# EAGLE schematic bc29_anz_a (EAGLE 7.2.0)
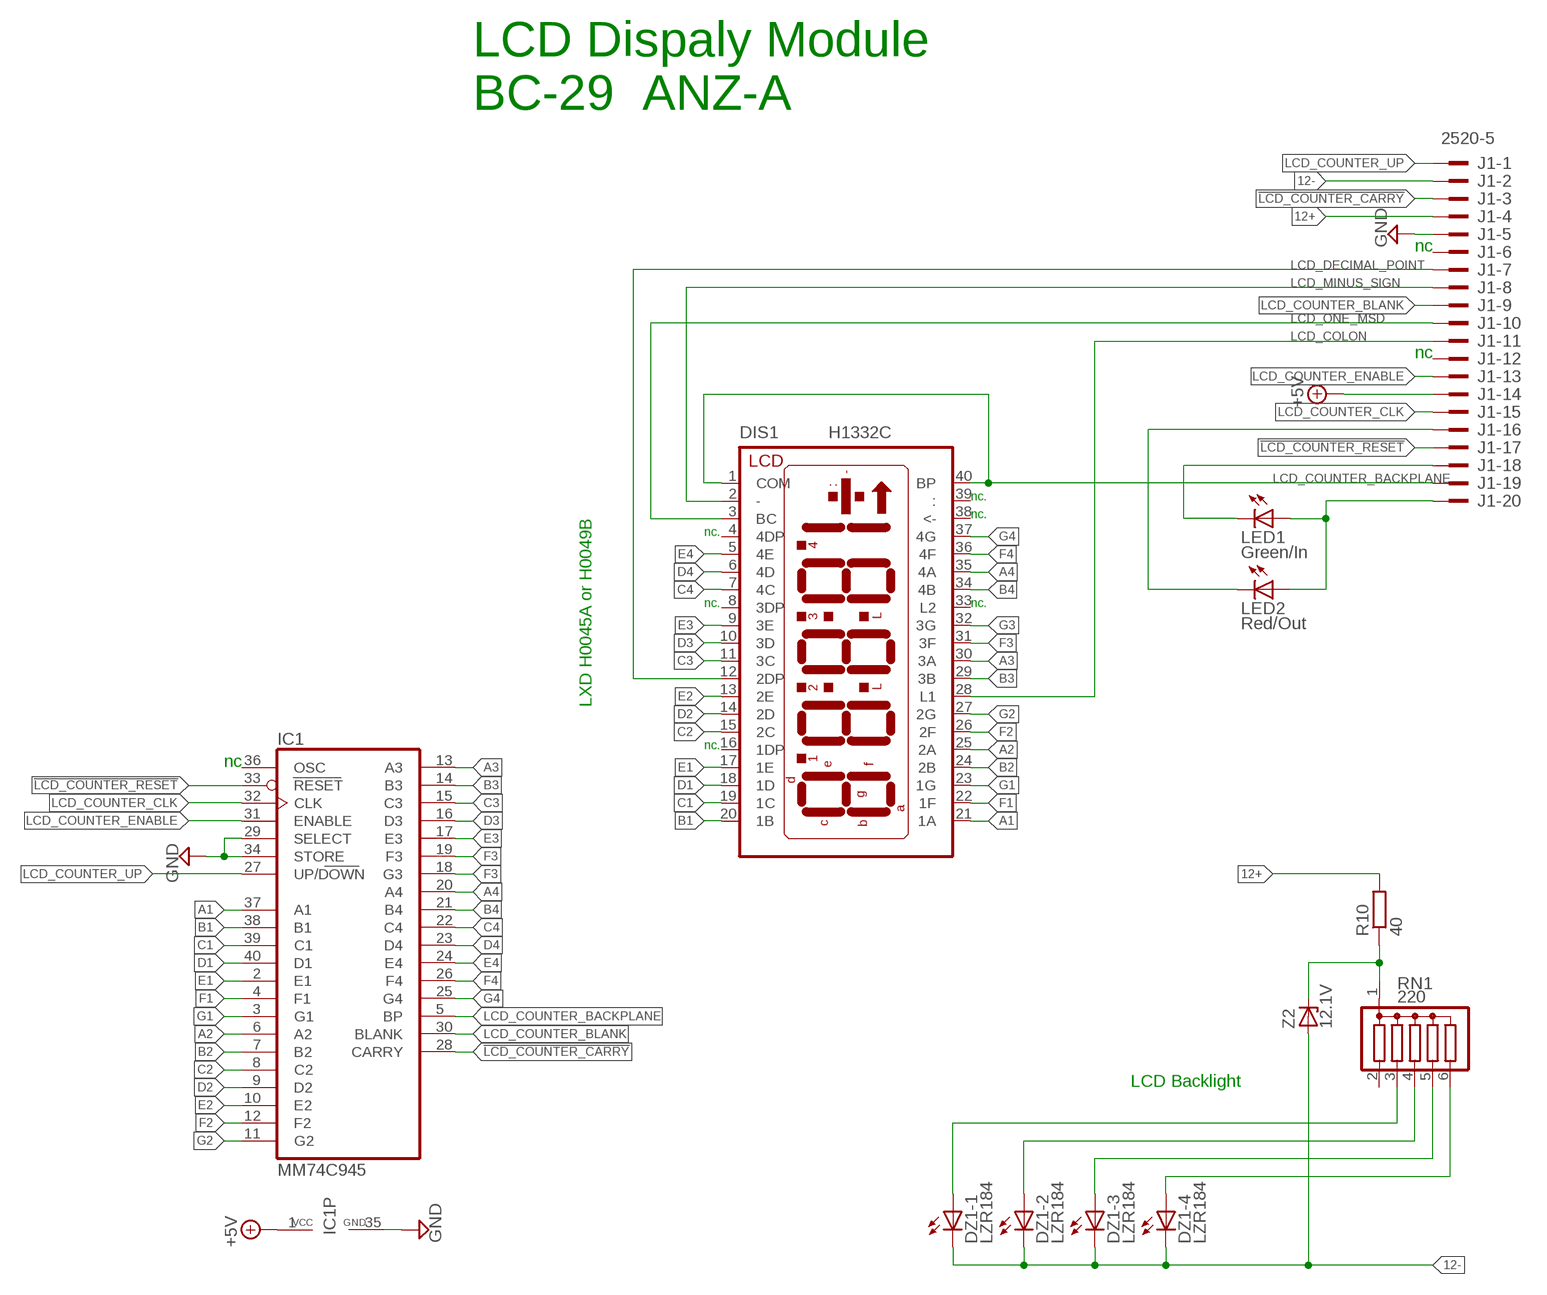
[diagram p0: schematic, sheet 1]

## Parts
DIS1  H1332C  [H1332C]
DZ1  LZR184  [LZR184]
IC1  MM74C945  [DIL40]
J1  2520-5  [PAK100/2500-5-20]
LED1  Green/In  LED5MM  [LED5MM]
LED2  Red/Out  LED5MM  [LED5MM]
R10  40  R-EU_0207/10  [0207/10]
RN1  220  G05R  [SIL6]
Z2  12.1V  ZENER-DIODESOD80C  [SOD80C]

## Nets
12+: J1.4 R10.2
12-: DZ1.K1(-1:C) DZ1.K2(-2:C) DZ1.K3(-3:C) DZ1.K4(-4:C) J1.2 Z2.A
!IN_LED: J1.18 LED1.K(C)
!LCD_COUNTER_CARRY: IC1.28(CARRY) J1.3
!LCD_COUNTER_RESET: IC1.33(RESET) J1.17
!OUT_LED: J1.16 LED2.K(C)
+5V: J1.14
+12V: IC1.1(VCC) ; supply symbol labelled +5V
A1: DIS1.21(1A) IC1.37(A1)
A2: DIS1.25(2A) IC1.6(A2)
A3: DIS1.30(3A) IC1.13(A3)
A4: DIS1.35(4A) IC1.20(A4)
B1: DIS1.20(1B) IC1.38(B1)
B2: DIS1.24(2B) IC1.7(B2)
B3: DIS1.29(3B) IC1.14(B3)
B4: DIS1.34(4B) IC1.21(B4)
BL0: DZ1.A1(-1:A) RN1.3
BL1: DZ1.A2(-2:A) RN1.4
BL2: DZ1.A3(-3:A) RN1.5
BL3: DZ1.A4(-4:A) RN1.6
C1: DIS1.19(1C) IC1.39(C1)
C2: DIS1.15(2C) IC1.8(C2)
C3: DIS1.11(3C) IC1.15(C3)
C4: DIS1.7(4C) IC1.22(C4)
D1: DIS1.18(1D) IC1.40(D1)
D2: DIS1.14(2D) IC1.9(D2)
D3: DIS1.10(3D) IC1.16(D3)
D4: DIS1.6(4D) IC1.23(D4)
E1: DIS1.17(1E) IC1.2(E1)
E2: DIS1.13(2E) IC1.10(E2)
E3: DIS1.9(3E) IC1.17(E3)
E4: DIS1.5(4E) IC1.24(E4)
F1: DIS1.22(1F) IC1.4(F1)
F2: DIS1.26(2F) IC1.12(F2)
F3: DIS1.31(3F) IC1.19(F3)
F4: DIS1.36(4F) IC1.26(F4)
G1: DIS1.23(1G) IC1.3(G1)
G2: DIS1.27(2G) IC1.11(G2)
G3: DIS1.32(3G) IC1.18(G3)
G4: DIS1.37(4G) IC1.25(G4)
GND: IC1.29(SELECT) IC1.34(STORE) IC1.35(GND) J1.5
LCD_COLON: DIS1.28(L1) J1.11
LCD_COUNTER_BACKPLANE: DIS1.1(COM) DIS1.40(BP) IC1.5(BP) J1.19
LCD_COUNTER_BLANK: IC1.30(BLANK) J1.9
LCD_COUNTER_CLK: IC1.32(CLK) J1.15
LCD_COUNTER_ENABLE: IC1.31(ENABLE) J1.13
LCD_COUNTER_UP: IC1.27(UP/DOWN) J1.1
LCD_DECIMAL_POINT: DIS1.12(2DP) J1.7
LCD_MINUS_SIGN: DIS1.2(-) J1.8
LCD_ONE_MSD: DIS1.3(BC) J1.10
LED_ANODE: J1.20 LED1.A LED2.A
LED_V+: R10.1 RN1.1 Z2.C
Unconnected: DIS1.4(4DP) DIS1.8(3DP) DIS1.16(1DP) DIS1.33(L2) DIS1.38(<-) DIS1.39(:) IC1.36(OSC) J1.6 J1.12 RN1.2

## Notes on the sheet
- LCD Dispaly Module
- BC-29  ANZ-A
- nc
- nc
- nc.
- LXD H0045A or H0049B | nc.
- nc.
- nc. | nc.
- nc.
- nc
- LCD Backlight

## Library data of the parts
DIS1 = display-lcd:H1332C: LCD DISPLAY 4 1/2-character 7 segment; OC_FARNELL: unknown; OC_NEWARK: unknown
DZ1 = led:LZR184: LED BLOCK 4 LEDs, Siemens
IC1 = maxim:MM74C945: COUNTER; OC_FARNELL: unknown; OC_NEWARK: unknown
J1 = con-3m:2520-: 3M (TM) Pak 100 4-Wall Header Source: 3M; MPN: D2520-5002-AR; OC_FARNELL: unknown; OC_NEWARK: 12P7058
LED1 LED2 = led:LED: LED OSRAM: - CHIPLED LG R971, LG N971, LY N971, LG Q971, LY Q971, LO R971, LY R971 LH N974, LH R974 LS Q976, LO Q976, LY Q976 LO Q996 - Hyper CHIPLED LW Q18S LB Q993, LB Q99A, LB R99A - SideLED LS A670, LO A670, LY A670, LG A670, LP A670 LB A673, LV A673, LT A673, LW A673 LH A674 LY A675 LS A676, LA A676, LO A676, LY A676, LW A676 LS A679, LY A679, LG A679 - Hyper Micro SIDELED® LS Y876, LA Y876, LO Y876, LY Y876 LT Y87S - SmartLED LW L88C, LW L88S LB L89C, LB L89S, LG L890 LS L89K, LO L89K, LY L89K LS L896, LA L896, LO L896, LY L896 - TOPLED LS T670, LO T670, LY T670, LG T670, LP T670 LSG T670, LSP T670, LSY T670, LOP T670, LYG T670 LG T671, LOG T671, LSG T671 LB T673, LV T673, LT T673, LW T673 LH T674 LS T676, LA T676, LO T676, LY T676, LB T676, LH T676, LSB T676, LW T676 LB T67C, LV T67C, LT T67C, LS T67K, LO T67K, LY T67K, LW E67C LS E67B, LA E67B, LO E67B, LY E67B, LB E67C, LV E67C, LT E67C LW T67C LS T679, LY T679, LG T679 LS T770, LO T770, LY T770, LG T770, LP T770 LB T773, LV T773, LT T773, LW T773 LH T774 LS E675, LA E675, LY E675, LS T675 LS T776, LA T776, LO T776, LY T776, LB T776 LHGB T686 LT T68C, LB T68C - Hyper Mini TOPLED® LB M676 - Mini TOPLED Santana® LG M470 LS M47K, LO M47K, LY M47K Source: http://www.osram.convergy.de LUXEON: - LUMILED® LXK2-PW12-R00, LXK2-PW12-S00, LXK2-PW14-U00, LXK2-PW14-V00 LXK2-PM12-R00, LXK2-PM12-S00, LXK2-PM14-U00 LXK2-PE12-Q00, LXK2-PE12-R00, LXK2-PE12-S00, LXK2-PE14-T00, LXK2-PE14-U00 LXK2-PB12-K00, LXK2-PB12-L00, LXK2-PB12-M00, LXK2-PB14-N00, LXK2-PB14-P00, LXK2-PB14-Q00 LXK2-PR12-L00, LXK2-PR12-M00, LXK2-PR14-Q00, LXK2-PR14-R00 LXK2-PD12-Q00, LXK2-PD12-R00, LXK2-PD12-S00 LXK2-PH12-R00, LXK2-PH12-S00 LXK2-PL12-P00, LXK2-PL12-Q00, LXK2-PL12-R00 Source: www.luxeon.com KINGBRIGHT: KA-3528ASYC Source: www.kingbright.com
R10 = rcl:R-EU_: RESISTOR, European symbol
RN1 = resistor-sil:G05R: SIL RESISTOR; OC_FARNELL: unknown; OC_NEWARK: unknown
Z2 = diode:ZENER-DIODE: Z-Diode